# Altium schematic sheet [07] - OUTPUT.SchDoc
size A3; DocumentNumber: 7; SheetNumber: 7; SheetTotal: 9
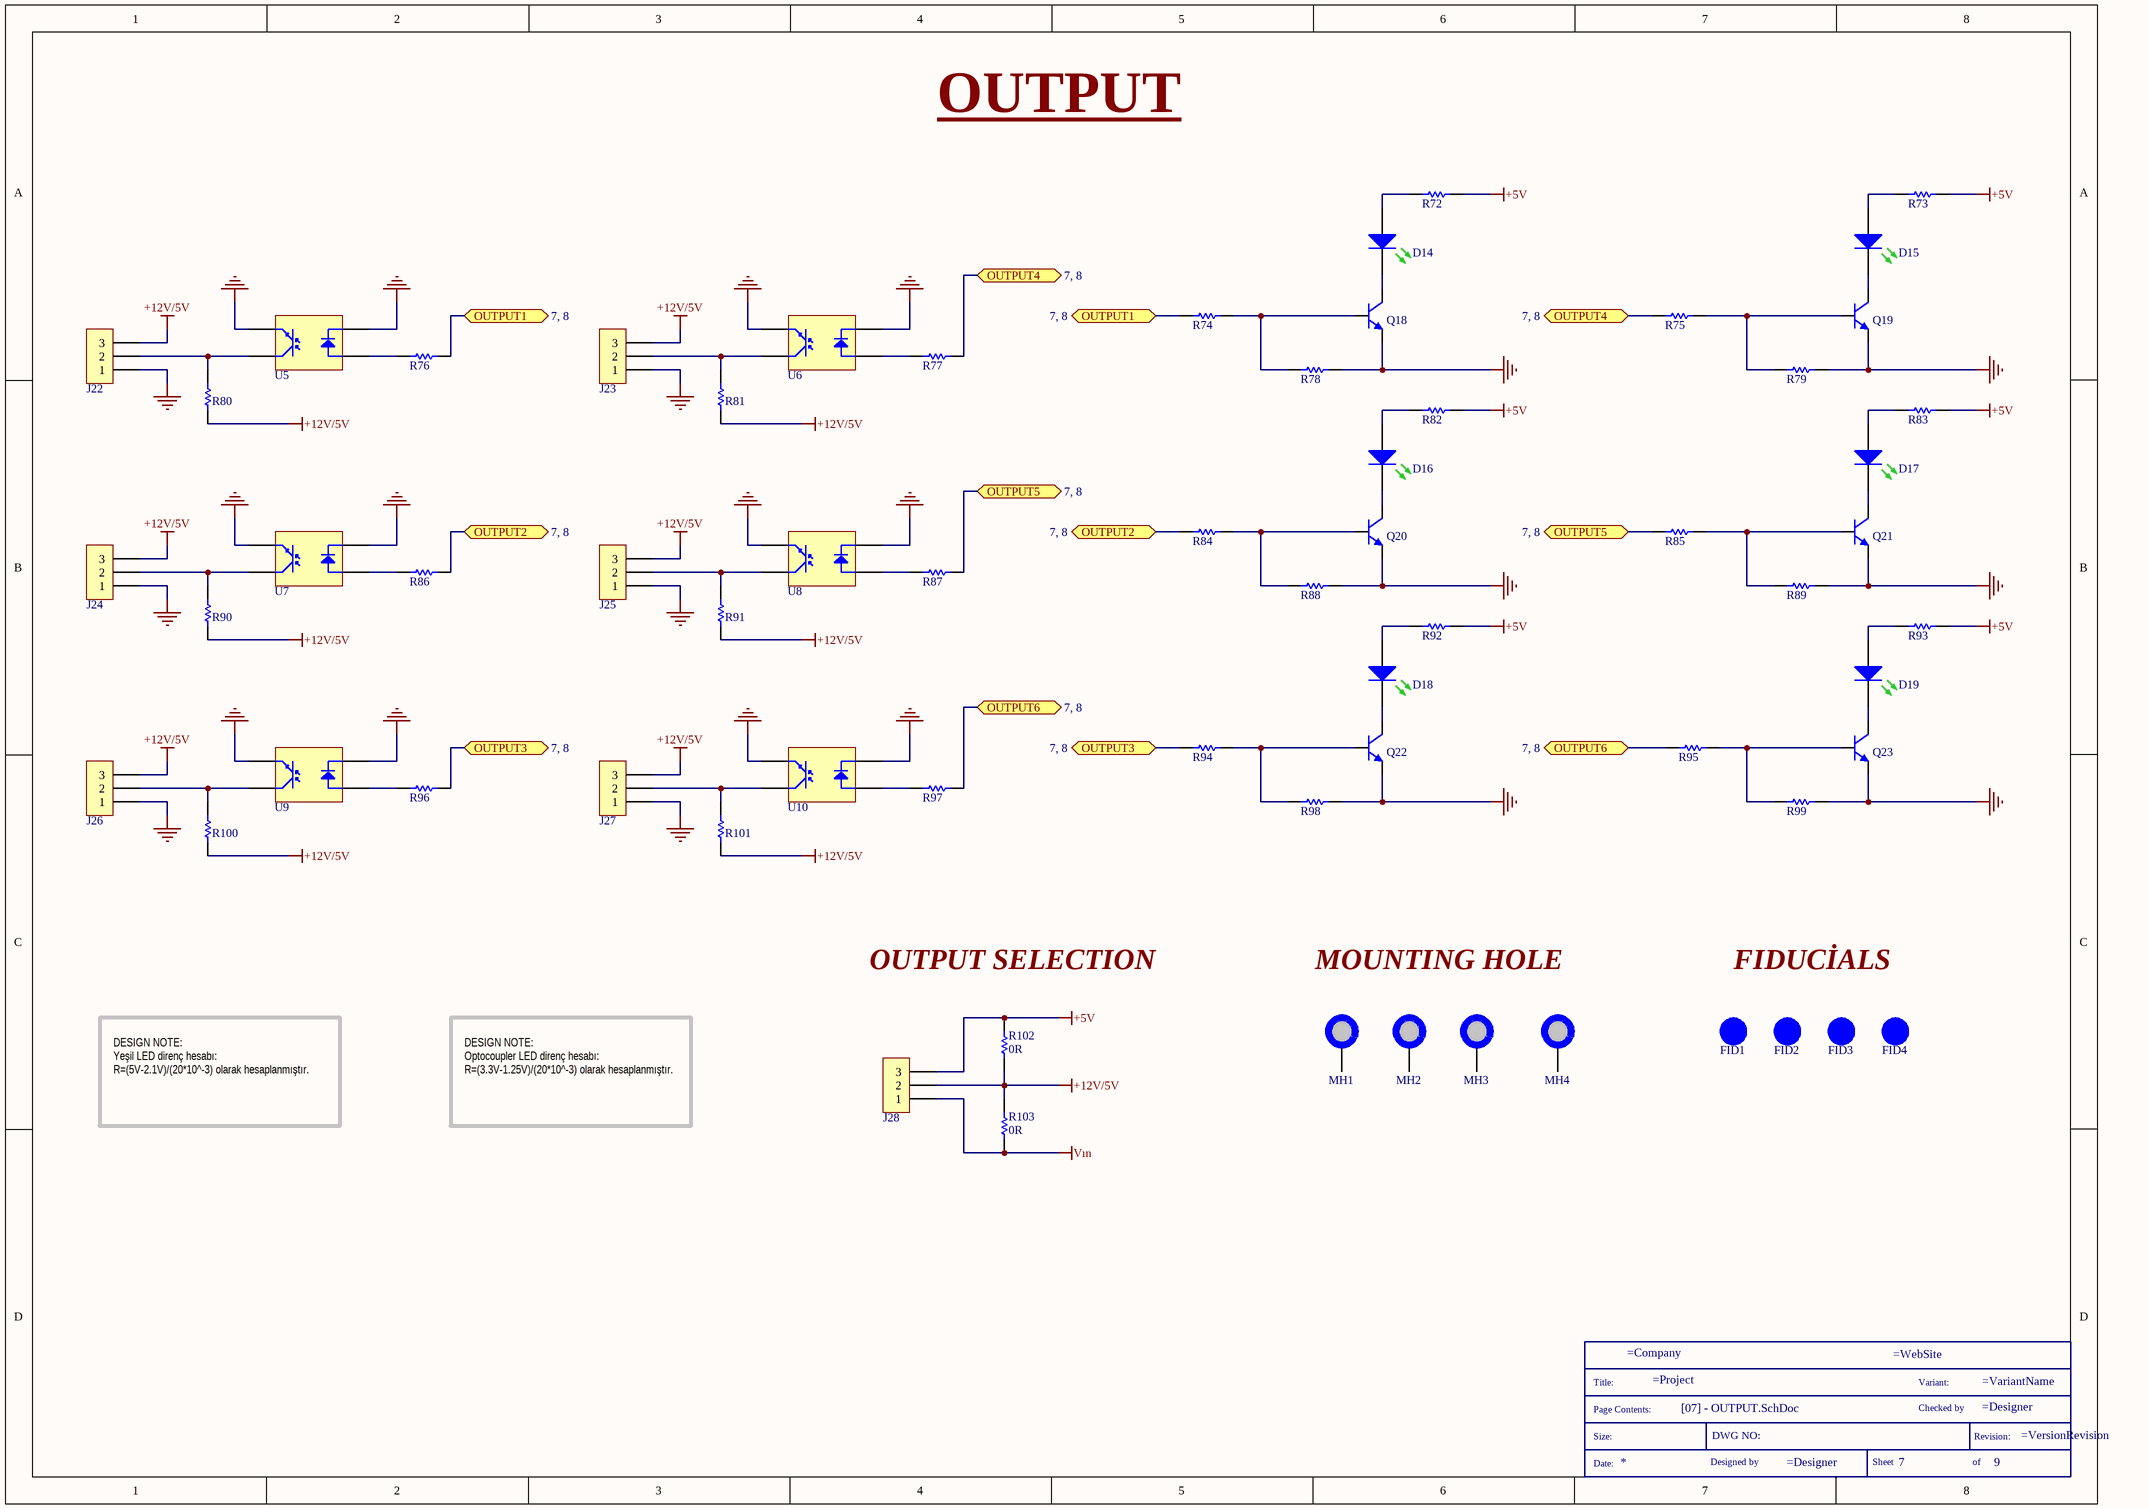
[diagram p0: [07] - OUTPUT.SchDoc]

## Parts
*  SCH_TITLE  (value not drawn)  (graphical)
D14  LED GREEN  [PLCC2]  (value not drawn)
D15  LED GREEN  [PLCC2]  (value not drawn)
D16  LED GREEN  [PLCC2]  (value not drawn)
D17  LED GREEN  [PLCC2]  (value not drawn)
D18  LED GREEN  [PLCC2]  (value not drawn)
D19  LED GREEN  [PLCC2]  (value not drawn)
FID1  FID_1MMC  [FID_40x120D]  (value not drawn)  (no BOM)
FID2  FID_1MMC  [FID_40x120D]  (value not drawn)  (no BOM)
FID3  FID_1MMC  [FID_40x120D]  (value not drawn)  (no BOM)
FID4  FID_1MMC  [FID_40x120D]  (value not drawn)  (no BOM)
J22  CONN 1X3 3MM  [CONN_MALE_1X3_3MM]  (value not drawn)
J23  CONN 1X3 3MM  [CONN_MALE_1X3_3MM]  (value not drawn)
J24  CONN 1X3 3MM  [CONN_MALE_1X3_3MM]  (value not drawn)
J25  CONN 1X3 3MM  [CONN_MALE_1X3_3MM]  (value not drawn)
J26  CONN 1X3 3MM  [CONN_MALE_1X3_3MM]  (value not drawn)
J27  CONN 1X3 3MM  [CONN_MALE_1X3_3MM]  (value not drawn)
J28  HDR_1X3_2.54  [HDR_MALE_1X3_2.54MM]  (value not drawn)
MH1  MH_3mm  [MH_3MM]  (value not drawn)  (no BOM)
MH2  MH_3mm  [MH_3MM]  (value not drawn)  (no BOM)
MH3  MH_3mm  [MH_3MM]  (value not drawn)  (no BOM)
MH4  MH_3mm  [MH_3MM]  (value not drawn)  (no BOM)
Q18  NPN 0.6A  [SOT-23 (TO-236)]  (value not drawn)
Q19  NPN 0.6A  [SOT-23 (TO-236)]  (value not drawn)
Q20  NPN 0.6A  [SOT-23 (TO-236)]  (value not drawn)
Q21  NPN 0.6A  [SOT-23 (TO-236)]  (value not drawn)
Q22  NPN 0.6A  [SOT-23 (TO-236)]  (value not drawn)
Q23  NPN 0.6A  [SOT-23 (TO-236)]  (value not drawn)
R72  140 1/8W  [RES_0805]  (value not drawn)
R73  140 1/8W  [RES_0805]  (value not drawn)
R74  10K 1/8W  [RES_0805]  (value not drawn)
R75  10K 1/8W  [RES_0805]  (value not drawn)
R76  100 1/8W  [RES_0805]  (value not drawn)
R77  100 1/8W  [RES_0805]  (value not drawn)
R78  100K 1/4W  [RES_0603]  (value not drawn)
R79  100K 1/4W  [RES_0603]  (value not drawn)
R80  5.6k 1/8W  [RES_0805]  (value not drawn)
R81  5.6k 1/8W  [RES_0805]  (value not drawn)
R82  140 1/8W  [RES_0805]  (value not drawn)
R83  140 1/8W  [RES_0805]  (value not drawn)
R84  10K 1/8W  [RES_0805]  (value not drawn)
R85  10K 1/8W  [RES_0805]  (value not drawn)
R86  100 1/8W  [RES_0805]  (value not drawn)
R87  100 1/8W  [RES_0805]  (value not drawn)
R88  100K 1/4W  [RES_0603]  (value not drawn)
R89  100K 1/4W  [RES_0603]  (value not drawn)
R90  5.6k 1/8W  [RES_0805]  (value not drawn)
R91  5.6k 1/8W  [RES_0805]  (value not drawn)
R92  140 1/8W  [RES_0805]  (value not drawn)
R93  140 1/8W  [RES_0805]  (value not drawn)
R94  10K 1/8W  [RES_0805]  (value not drawn)
R95  10K 1/8W  [RES_0805]  (value not drawn)
R96  100 1/8W  [RES_0805]  (value not drawn)
R97  100 1/8W  [RES_0805]  (value not drawn)
R98  100K 1/4W  [RES_0603]  (value not drawn)
R99  100K 1/4W  [RES_0603]  (value not drawn)
R100  5.6k 1/8W  [RES_0805]  (value not drawn)
R101  5.6k 1/8W  [RES_0805]  (value not drawn)
R102  0R  [R0805]
R103  0R  [R0805]
U5  NPN 3.75KV  [SOIC-6]  (value not drawn)
U6  NPN 3.75KV  [SOIC-6]  (value not drawn)
U7  NPN 3.75KV  [SOIC-6]  (value not drawn)
U8  NPN 3.75KV  [SOIC-6]  (value not drawn)
U9  NPN 3.75KV  [SOIC-6]  (value not drawn)
U10  NPN 3.75KV  [SOIC-6]  (value not drawn)

## Ports
OUTPUT1 (see 7, 8), OUTPUT2 (see 7, 8), OUTPUT3 (see 7, 8), OUTPUT4 (see 7, 8), OUTPUT5 (see 7, 8), OUTPUT6 (see 7, 8)

## Nets
+5V: J28.3 R72.2 R73.2 R82.2 R83.2 R92.2 R93.2 R102.1
+12V/5V: J22.3 J23.3 J24.3 J25.3 J26.3 J27.3 J28.2 R80.1 R81.1 R90.1 R91.1 R100.1 R101.1 R102.2 R103.1
GND: J22.1 J23.1 J24.1 J25.1 J26.1 J27.1 Q18.3(E) Q19.3(E) Q20.3(E) Q21.3(E) Q22.3(E) Q23.3(E) R78.2 R79.2 R88.2 R89.2 R98.2 R99.2 U5.3(K) U5.4(Emit) U6.3(K) U6.4(Emit) U7.3(K) U7.4(Emit) U8.3(K) U8.4(Emit) U9.3(K) U9.4(Emit) U10.3(K) U10.4(Emit)
Vın: J28.1 R103.2
OUTPUT1: R74.1 R76.2 ; port OUTPUT1
OUTPUT2: R84.1 R86.2 ; port OUTPUT2
OUTPUT3: R94.1 R96.2 ; port OUTPUT3
OUTPUT4: R75.1 R77.2 ; port OUTPUT4
OUTPUT5: R85.1 R87.2 ; port OUTPUT5
OUTPUT6: R95.1 R97.2 ; port OUTPUT6
NetD14_1: D14.1(A) R72.1
NetD14_2: D14.2(K) Q18.1(C)
NetD15_1: D15.1(A) R73.1
NetD15_2: D15.2(K) Q19.1(C)
NetD16_1: D16.1(A) R82.1
NetD16_2: D16.2(K) Q20.1(C)
NetD17_1: D17.1(A) R83.1
NetD17_2: D17.2(K) Q21.1(C)
NetD18_1: D18.1(A) R92.1
NetD18_2: D18.2(K) Q22.1(C)
NetD19_1: D19.1(A) R93.1
NetD19_2: D19.2(K) Q23.1(C)
NetJ22_2: J22.2 R80.2 U5.6(Coll)
NetJ23_2: J23.2 R81.2 U6.6(Coll)
NetJ24_2: J24.2 R90.2 U7.6(Coll)
NetJ25_2: J25.2 R91.2 U8.6(Coll)
NetJ26_2: J26.2 R100.2 U9.6(Coll)
NetJ27_2: J27.2 R101.2 U10.6(Coll)
NetQ18_2: Q18.2(B) R74.2 R78.1
NetQ19_2: Q19.2(B) R75.2 R79.1
NetQ20_2: Q20.2(B) R84.2 R88.1
NetQ21_2: Q21.2(B) R85.2 R89.1
NetQ22_2: Q22.2(B) R94.2 R98.1
NetQ23_2: Q23.2(B) R95.2 R99.1
NetR76_1: R76.1 U5.1(A)
NetR77_1: R77.1 U6.1(A)
NetR86_1: R86.1 U7.1(A)
NetR87_1: R87.1 U8.1(A)
NetR96_1: R96.1 U9.1(A)
NetR97_1: R97.1 U10.1(A)

Not connected (* = marked no-connect by the designer): MH1 1; MH2 1; MH3 1; MH4 1

## Notes on the sheet
- OUTPUT
- OUTPUT SELECTION
- MOUNTING HOLE
- FIDUCİALS
- DESIGN NOTE:
  Yeşil LED direnç hesabı:
  R=(5V-2.1V)/(20*10^-3) olarak hesaplanmıştır.
- DESIGN NOTE:
  Optocoupler LED direnç hesabı:
  R=(3.3V-1.25V)/(20*10^-3) olarak hesaplanmıştır.
- (in symbol SCH_TITLE) Title:; Variant:; Page Contents:; Checked by; Size:; DWG NO:; Revision:; Date:; Designed by; Sheet; of

## Library data of the parts
* = SCH_TITLE: Schematic information
D14-D19 = LP T67F-P1R2-35-1-20-R18-Z: LED TOPLED GREEN 562NM 2PLCC; Manufacturer 1: OSRAM Opto Semiconductors Inc.; Category: LED Lighting - Color; Manufacturer Part Number 1: LP T67F-P1R2-35-1-20-R18-Z; Case/Package: 2-PLCC; Quantity: 1; Supplier 1: Digikey; Supplier Part Number 1: 475-3760-1-ND; Supplier Order Qty 1: 1; Supplier Stock 1: 1903; Supplier Unit Price 1: 0,67; Supplier Currency 1: $
FID1-FID4 = FID_1MMC: Fiducial 40 mil diameter , 120 mil mask
J22-J27 = 66200311122: CONN MALE 1X3 3MM; Manufacturer 1: Wurth Electronics Inc.; Category: Rectangular Connectors - Headers, Male Pins; Manufacturer Part Number 1: 66200311122; Case/Package: 3POS_3mmPitch; Quantity: 1; Supplier 1: Digikey; Supplier Part Number 1: 732-4709-5-ND; Supplier Order Qty 1: 1; Supplier Stock 1: 56; Supplier Unit Price 1: 0,34; Supplier Currency 1: $
J28 = 61300311121: HDR MALE 1X3 2.54MM; Manufacturer 1: Wurth Electronics Inc.; Category: Rectangular Connectors - Headers, Male Pins; Manufacturer Part Number 1: 61300311121; Case/Package: 3POS pitch 2.54mm; Quantity: 1; Supplier 1: Digikey; Supplier Part Number 1: 732-5316-ND; Supplier Order Qty 1: 1; Supplier Stock 1: 109116; Supplier Unit Price 1: 0,13; Supplier Currency 1: $
MH1-MH4 = Mounting Hole 3mm: Mounting Hole 3 mm; Category: M3 3mm çap vida
Q18-Q23 = MMBT2222A-7-F: TRANS NPN 40V 0.6A SMD SOT23-3; Manufacturer 1: Diodes Incorporated; Category: Transistors - Bipolar (BJT) - Single; Manufacturer Part Number 1: MMBT2222A-7-F; Case/Package: SOT-23-3; Quantity: 1; Supplier 1: Digikey; Supplier Part Number 1: MMBT2222A-FDICT-ND; Supplier Order Qty 1: 1; Supplier Stock 1: 1957039; Supplier Unit Price 1: 0,14; Supplier Currency 1: $
R72 R73 R82 R83 R92 R93 = ERJ-6ENF1400V: RES SMD 140 OHM 1% 1/8W 0805; Manufacturer 1: Panasonic Electronic Components; Category: Chip Resistor - Surface Mount; Manufacturer Part Number 1: ERJ-6ENF1400V; Case/Package: 0805 (2012 Metric); Quantity: 1; Supplier 1: Digikey; Supplier Part Number 1: P140CCT-ND; Supplier Order Qty 1: 1; Supplier Stock 1: 76818; Supplier Unit Price 1: 0,1; Supplier Currency 1: $
R74 R75 R84 R85 R94 R95 = ERJ-6ENF1002V: RES SMD 10K OHM 1% 1/8W 0805; Manufacturer 1: Panasonic Electronic Components; Category: Chip Resistor - Surface Mount; Manufacturer Part Number 1: ERJ-6ENF1002V; Case/Package: 0805 (2012 Metric); Quantity: 1; Supplier 1: Digikey; Supplier Part Number 1: P10.0KCCT-ND; Supplier Order Qty 1: 1; Supplier Stock 1: 2515107; Supplier Unit Price 1: 0,1; Supplier Currency 1: $
R76 R77 R86 R87 R96 R97 = ERJ-6ENF1000V: RES SMD 100 OHM; Manufacturer 1: Panasonic Electronic Components; Category: Chip Resistor - Surface Mount; Manufacturer Part Number 1: ERJ-6ENF1000V; Case/Package: 0805 (2012 Metric); Quantity: 1; Supplier 1: Digikey; Supplier Part Number 1: P100CCT-ND; Supplier Order Qty 1: 1; Supplier Stock 1: 728141; Supplier Unit Price 1: 0,1; Supplier Currency 1: $
R78 R79 R88 R89 R98 R99 = ERJ-PA3J104V: RES SMD 100K 5% 1/4W 0603; Manufacturer 1: Panasonic Electronic Components; Category: Chip Resistor - Surface Mount; Manufacturer Part Number 1: ERJ-PA3J104V; Case/Package: 0603 (1608 Metric); Quantity: 1; Supplier 1: Digikey; Supplier Part Number 1: P100KBZCT-ND; Supplier Order Qty 1: 1; Supplier Stock 1: 11465; Supplier Unit Price 1: 0,11; Supplier Currency 1: $
R80 R81 R90 R91 R100 R101 = ERJ-6ENF5601V: RES SMD 5.6K OHM 1% 1/8W 0805; Manufacturer 1: Panasonic Electronic Components; Category: Chip Resistor - Surface Mount; Manufacturer Part Number 1: ERJ-6ENF5601V; Case/Package: 0805 (2012 Metric); Quantity: 1; Supplier 1: Digikey; Supplier Part Number 1: P5.60KCCT-ND; Supplier Order Qty 1: 1; Supplier Stock 1: 71341; Supplier Unit Price 1: 0,1; Supplier Currency 1: $
R102 R103 = CRCW08050000Z0EA: RES SMD 0 OHM JUMPER 1/8W 0805; Manufacturer 1: Vishay Dale; Category: Chip Resistor - Surface Mount; Manufacturer Part Number 1: CRCW08050000Z0EA; Case/Package: 0805 (2012 Metric); Quantity: 1; Supplier 1: Digikey; Supplier Part Number 1: 541-0.0ACT-ND; Supplier Order Qty 1: 1; Supplier Stock 1: 609778; Supplier Unit Price 1: 0,10; Supplier Currency 1: $
U5-U10 = TLP2301(TPL,E: OPTOISO 3.75KV TRANS; Manufacturer 1: Toshiba Semiconductor and Storage; Category: Optoisolators - Transistor, Photovoltaic Output; Manufacturer Part Number 1: TLP2301(TPL,E; Case/Package: 6-SOIC (0.179", 4.55mm Width), 4 Leads; Quantity: 1; Supplier 1: Digikey; Supplier Part Number 1: TLP2301(TPLECT-ND; Supplier Order Qty 1: 1; Supplier Stock 1: 19225; Supplier Unit Price 1: 0,73; Supplier Currency 1: $